# EAGLE design pH_tl082_v3 (EAGLE 9.2.2)
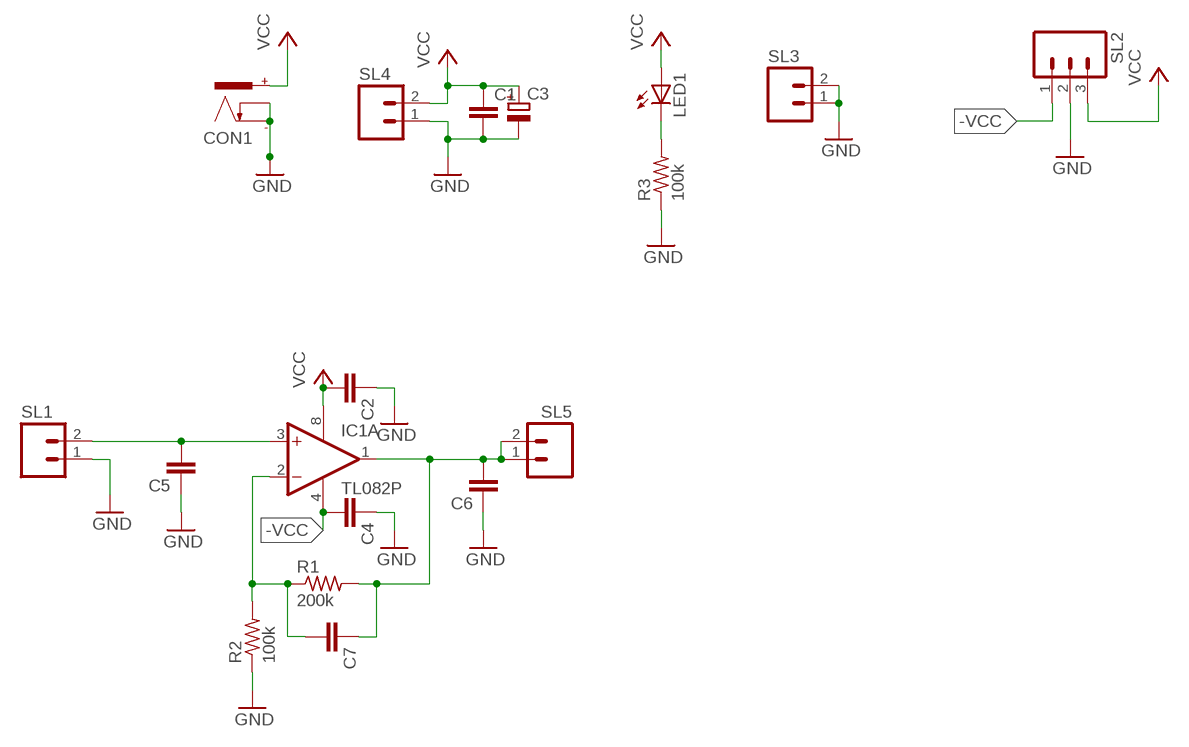
[diagram p0: schematic, sheet 1]

## Parts
C1  C2.5/2  [C2.5-2]
C2  C2.5/2  [C2.5-2]
C3  CPOL-EUE2,5-6E  [E2,5-6E]
C4  C2.5/2  [C2.5-2]
C5  C2.5/2  [C2.5-2]
C6  C2.5/2  [C2.5-2]
C7  C2.5/2  [C2.5-2]
CON1  POWER_CON  [NEB21R]
IC1  TL082P  [DIL08]
LED1  LED3MM  [LED3MM]
R1  200k  RESISTOR0207/7  [0207/7]
R2  100k  RESISTOR0207/7  [0207/7]
R3  100k  RESISTOR0207/7  [0207/7]
SL1  M02  [02P]
SL2  M03  [03P]
SL3  M02  [02P]
SL4  M02  [02P]
SL5  M02  [02P]

## Nets
-VCC: C4.2 IC1.4(P:V-) SL2.1
GND: C1.2 C2.1 C3.- C4.1 C5.1 C6.1 CON1.- CON1.C R2.1 R3.1 SL1.1 SL2.2 SL3.1 SL3.2 SL4.1
N$1: C5.2 IC1.3(A:+IN) SL1.2
N$2: C7.2 IC1.2(A:-IN) R1.1 R2.2
N$3: C6.2 C7.1 IC1.1(A:OUT) R1.2 SL5.1 SL5.2
N$4: LED1.K(C) R3.2
VCC: C1.1 C2.2 C3.+ CON1.+ IC1.8(P:V+) LED1.A SL2.3 SL4.2
Unconnected: IC1.5(B:+IN) IC1.6(B:-IN) IC1.7(B:OUT)

## Library data of the parts
C1 C2 C4-C7 = capacitor-wima:C: CAPACITOR naming: grid - package width
C3 = rcl:CPOL-EU: POLARIZED CAPACITOR, European symbol; SPICEPREFIX: C
CON1 = CEDT_JANUARY_2015_v7:POWER_CON: DC Power Connector
IC1 = linear:TL082: OP AMP Data sheet <http://www.ti.com/lit/ds/symlink/tl084a . pdf>; DATA_SHEET: <a href="http://www.ti.com/lit/ds/symlink/tl084a.pdf"> Data sheet </a>
LED1 = CEDT_JANUARY_2015_v7:LED
R1-R3 = CEDT_JANUARY_2015_v7:RESISTOR
SL1 SL3 SL5 = con-amp-quick:M02: AMP QUICK CONNECTOR; OC_FARNELL: unknown; OC_NEWARK: unknown
SL2 = con-amp-quick:M03: AMP QUICK CONNECTOR; OC_FARNELL: unknown; OC_NEWARK: unknown
SL4 = CEDT_JANUARY_2015_v7:M02: AMP QUICK CONNECTOR

## Board
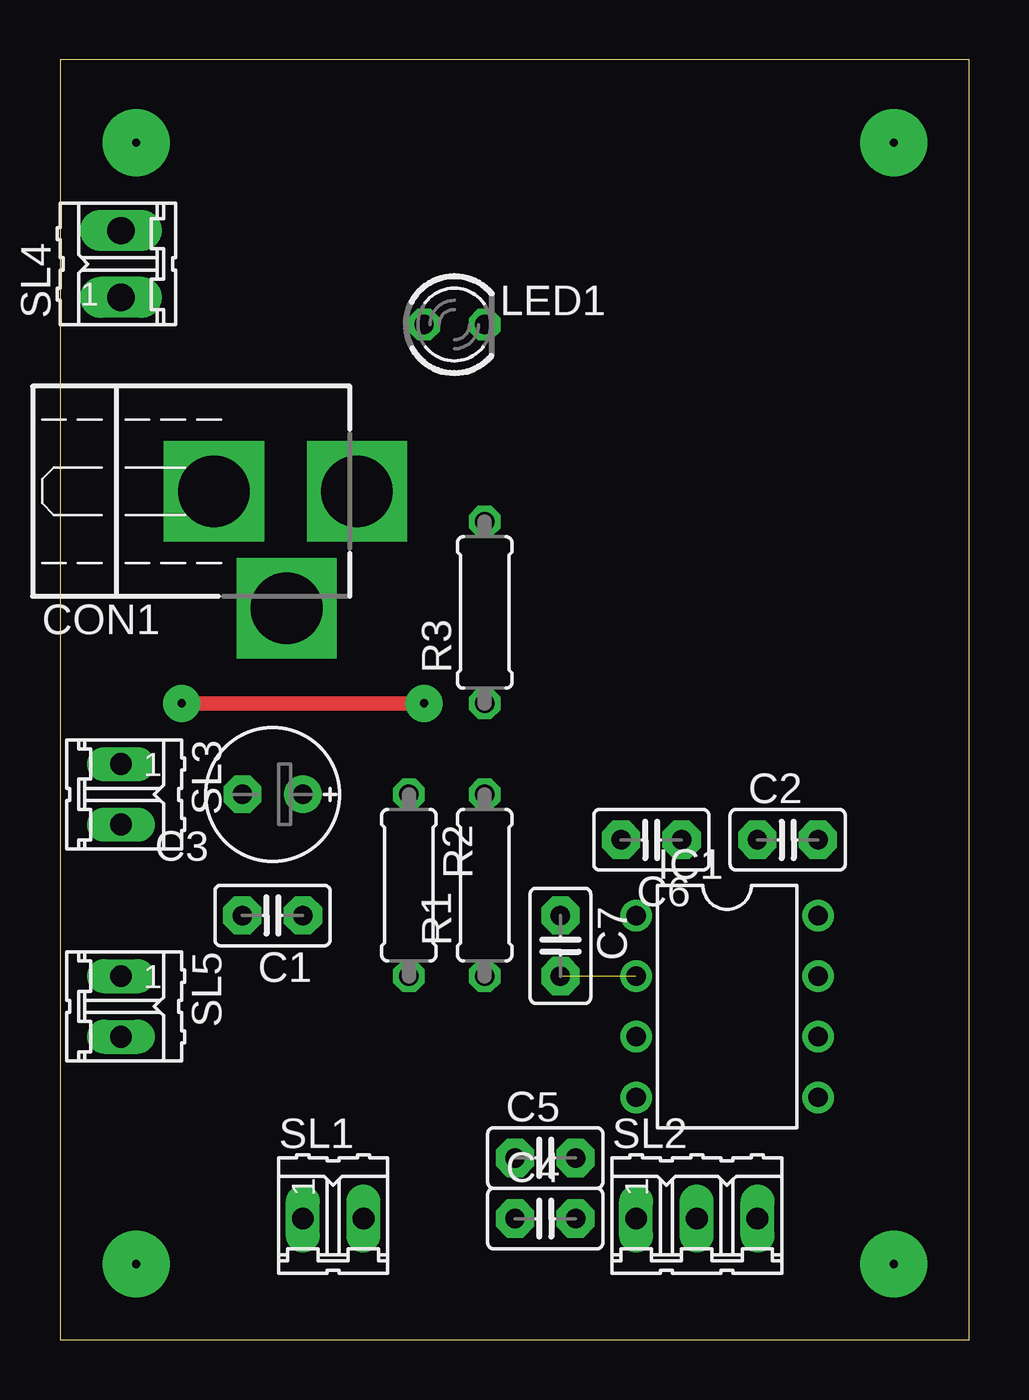
[diagram p1: board, top side]
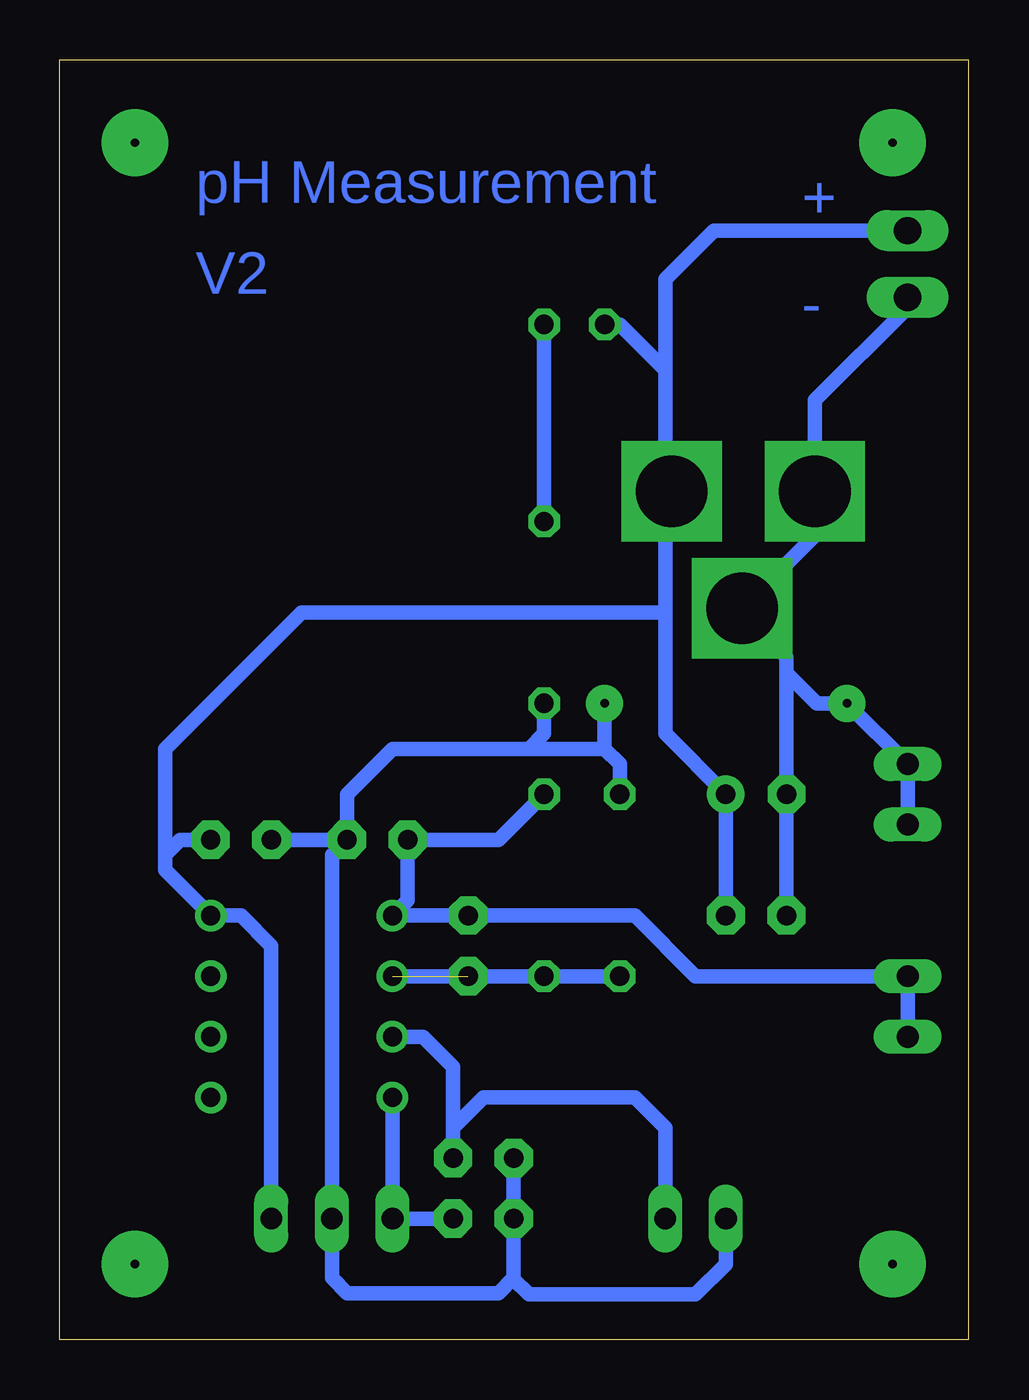
[diagram p2: board, bottom side, seen from below]

Size 38.08 x 53.65 mm. Coordinates in mm from the lower left corner, seen from the top.
Outline: 0,0 38.08,0 38.08,53.65 0,53.65 0,0
Copper layers (1*16): Top 0.035mm / dielectric 1.5mm / Bottom 0.035mm
Design rules "default": minimum track width 6mil, minimum drill 0.35mm, track to track 6mil, track to pad 6mil, pad to pad 6mil, via to via 6mil, smd to smd 6mil, copper to edge 40mil, drill to drill 6mil, minimum pad ring 10mil, minimum via ring 8mil, stop-mask expansion 4mil, vias tented up to drill 0mil, thermal gap 10mil

### Footprints (pad centres in the part's own frame; a part is rotated, then mirrored left to right if it is on the bottom)
C2.5-2 = drill 0.813 pad 1.6 octagon: 1 -1.27,0; 2 1.27,0
E2,5-6E = drill 0.813 pad 1.575: + -1.27,0 | drill 0.813 pad 1.575 octagon: - 1.27,0
NEB21R = drill 3 pad 4.2 square: + 0,3.54; - 0,-2.46; C 4.9,0.59
DIL08 = drill 0.813 pad 1.27: 1 -3.81,-3.81; 2 -1.27,-3.81; 3 1.27,-3.81; 4 3.81,-3.81; 5 3.81,3.81; 6 1.27,3.81; 7 -1.27,3.81; 8 -3.81,3.81
LED3MM = drill 0.813 octagon: A -1.27,0; K 1.27,0
0207/7 = drill 0.813 octagon: 1 -3.81,0; 2 3.81,0
02P = drill 0.914 long: 1 -1.27,0; 2 1.27,0
03P = drill 0.914 long: 1 -2.54,0; 2 0,0; 3 2.54,0
02P' = drill 1.143 long: 1 -1.397,0; 2 1.397,0

### Placement (x,y rotation side)
C1  8.89,17.78 180 top
C2  30.48,20.95 0 top
C3  8.89,22.86 180 top
C4  20.32,5.08 0 top
C5  20.32,7.62 0 top
C6  24.77,20.95 180 top
C7  20.95,16.51 270 top
CON1  8.89,35.56 270 top
IC1  27.94,13.97 270 top
LED1  16.51,42.55 0 top
R1  17.78,19.05 90 top
R2  14.61,19.05 270 top
R3  17.78,30.48 90 top
SL1  11.43,5.08 0 top
SL2  26.67,5.08 0 top
SL3  2.54,22.86 270 top
SL4  [02P']  2.54,45.09 90 top
SL5  2.54,13.97 270 top

### Tracks (layer width: path | path; a pad name or v marks a point on that pad's centre or on a via)
-VCC
  Bottom 0.61: IC1.4 SL2.1 C4.2
GND  (via drill 0.35 pad 1.55)
  Top 0.61: v5.08,26.67 v15.24,26.67
  Bottom 0.61: SL4.1 2.54,43.26 6.43,39.37 CON1.- 6.43,33.71 CON1.C 9.48,30.48 7.62,28.62 7.62,27.94 | C1.2 C3.- 7.62,27.94 | 18.41,24.77 15.24,24.77 | 18.41,24.77 24.13,24.77 26.04,22.86 C6.1 | C6.1 26.67,20.32 SL2.2 26.67,2.59 26.04,1.96 19.68,1.96 19.05,2.59 C4.1 C5.1 | SL1.1 10.16,3.17 11.43,1.91 18.41,1.91 19.05,2.54 | 7.62,27.94 6.35,26.67 v5.08,26.67 SL3.1 SL3.2 | C6.1 C2.1 | R3.1 17.78,25.4 18.41,24.77 | 15.24,24.77 14.61,24.13 R2.1 | 15.24,24.77 v15.24,26.67
N$1
  Bottom 0.61: SL1.2 12.7,8.89 13.97,10.16 20.32,10.16 21.59,8.89 C5.2 21.59,11.43 22.86,12.7 IC1.3
N$2  (1 unrouted)
  Bottom 0.61: R2.2 R1.1 IC1.2
N$3
  Bottom 0.61: R1.2 19.68,20.95 C6.2 23.5,18.41 IC1.1 C7.1 13.97,17.78 11.43,15.24 SL5.1 SL5.2
N$4
  Bottom 0.61: R3.2 LED1.K
N$5  (via drill 0.35 pad 2.79)
  other vias: 3.17,50.16
N$6  (via drill 0.35 pad 2.79)
  other vias: 34.92,50.16
N$7  (via drill 0.35 pad 2.79)
  other vias: 34.92,3.17
N$8  (via drill 0.35 pad 2.79)
  other vias: 3.17,3.17
VCC
  Bottom 0.61: SL4.2 10.67,46.48 12.7,44.45 12.7,40.64 | 12.7,40.64 12.7,35.56 | 12.7,35.56 CON1.+ | C1.1 C3.+ 12.7,25.4 12.7,30.48 | 12.7,30.48 12.7,35.56 | SL2.3 29.21,16.51 30.48,17.78 IC1.8 33.66,19.68 33.66,20.32 | 12.7,30.48 27.94,30.48 33.66,24.77 33.66,20.32 | C2.2 33.02,20.95 33.66,20.32 | LED1.A 14.61,42.55 12.7,40.64

### Text on the board
Bottom: pH Measurement | + | V2 | -